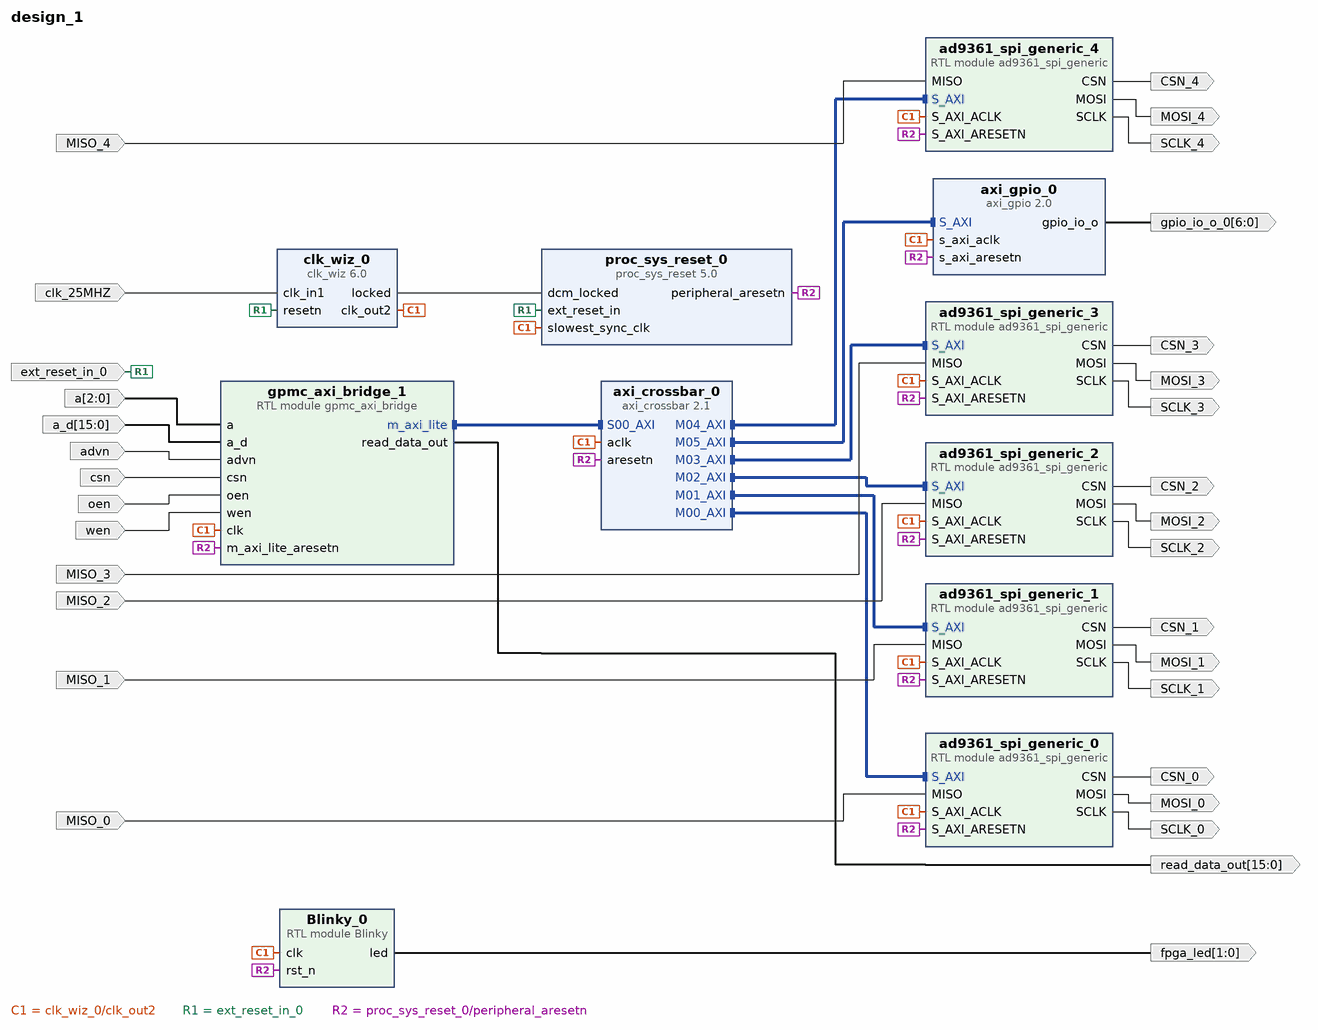
[diagram p0: block diagram of the top level]
# Vivado block design design_1, xc7a200tffg1156-1, Vivado 2025.2
create_bd_design design_1

create_bd_port -dir I advn
create_bd_port -dir I wen
create_bd_port -dir I oen
create_bd_port -dir I -from 15 -to 0 a_d
create_bd_port -dir I csn
create_bd_port -dir I -from 2 -to 0 a
create_bd_port -dir O CSN_0
create_bd_port -dir I MISO_0
create_bd_port -dir O MOSI_0
create_bd_port -dir O SCLK_0
create_bd_port -dir I MISO_1
create_bd_port -dir O MOSI_1
create_bd_port -dir O SCLK_1
create_bd_port -dir O CSN_1
create_bd_port -dir I MISO_2
create_bd_port -dir O SCLK_2
create_bd_port -dir O MOSI_2
create_bd_port -dir O CSN_2
create_bd_port -dir O SCLK_3
create_bd_port -dir O MOSI_3
create_bd_port -dir I MISO_3
create_bd_port -dir O CSN_3
create_bd_port -dir O SCLK_4
create_bd_port -dir O MOSI_4
create_bd_port -dir I MISO_4
create_bd_port -dir O CSN_4
create_bd_port -dir I -type clk clk_25MHZ
set_property -dict {CONFIG.FREQ_HZ 25000000} [get_bd_ports clk_25MHZ]
create_bd_port -dir I -type rst ext_reset_in_0
create_bd_port -dir O -from 15 -to 0 read_data_out
create_bd_port -dir O -from 1 -to 0 fpga_led
create_bd_port -dir O -from 6 -to 0 gpio_io_o_0

create_bd_cell -type module -reference gpmc_axi_bridge gpmc_axi_bridge_1
create_bd_cell -type module -reference ad9361_spi_generic ad9361_spi_generic_0
create_bd_cell -type module -reference ad9361_spi_generic ad9361_spi_generic_1
create_bd_cell -type module -reference ad9361_spi_generic ad9361_spi_generic_2
create_bd_cell -type module -reference ad9361_spi_generic ad9361_spi_generic_3
create_bd_cell -type module -reference ad9361_spi_generic ad9361_spi_generic_4
create_bd_cell -type ip -vlnv xilinx.com:ip:clk_wiz:6.0 clk_wiz_0
set_property -dict [list \
  CONFIG.CLKIN1_JITTER_PS 400.0 \
  CONFIG.CLKOUT1_JITTER 356.129 \
  CONFIG.CLKOUT1_PHASE_ERROR 237.727 \
  CONFIG.CLKOUT1_REQUESTED_OUT_FREQ 25 \
  CONFIG.CLKOUT2_JITTER 226.965 \
  CONFIG.CLKOUT2_PHASE_ERROR 237.727 \
  CONFIG.CLKOUT2_USED true \
  CONFIG.CLKOUT3_JITTER 206.578 \
  CONFIG.CLKOUT3_PHASE_ERROR 237.727 \
  CONFIG.CLKOUT3_REQUESTED_OUT_FREQ 200 \
  CONFIG.CLKOUT3_USED true \
  CONFIG.CLKOUT4_JITTER 220.126 \
  CONFIG.CLKOUT4_PHASE_ERROR 237.727 \
  CONFIG.CLKOUT4_REQUESTED_OUT_FREQ 125 \
  CONFIG.CLKOUT4_USED true \
  CONFIG.MMCM_CLKFBOUT_MULT_F 40.000 \
  CONFIG.MMCM_CLKIN1_PERIOD 40.000 \
  CONFIG.MMCM_CLKIN2_PERIOD 10.0 \
  CONFIG.MMCM_CLKOUT0_DIVIDE_F 40.000 \
  CONFIG.MMCM_CLKOUT1_DIVIDE 10 \
  CONFIG.MMCM_CLKOUT2_DIVIDE 5 \
  CONFIG.MMCM_CLKOUT3_DIVIDE 8 \
  CONFIG.NUM_OUT_CLKS 4 \
  CONFIG.PRIM_IN_FREQ 25 \
  CONFIG.RESET_PORT resetn \
  CONFIG.RESET_TYPE ACTIVE_LOW \
] [get_bd_cells clk_wiz_0]
create_bd_cell -type ip -vlnv xilinx.com:ip:proc_sys_reset:5.0 proc_sys_reset_0
create_bd_cell -type ip -vlnv xilinx.com:ip:axi_crossbar:2.1 axi_crossbar_0
set_property -dict {CONFIG.ADDR_WIDTH 19 CONFIG.NUM_MI 6 CONFIG.PROTOCOL AXI4LITE} [get_bd_cells axi_crossbar_0]
create_bd_cell -type module -reference Blinky Blinky_0
set_property -dict {CONFIG.BUS_WIDTH 2} [get_bd_cells Blinky_0]
create_bd_cell -type ip -vlnv xilinx.com:ip:axi_gpio:2.0 axi_gpio_0
set_property -dict {CONFIG.C_ALL_OUTPUTS 1 CONFIG.C_GPIO_WIDTH 7} [get_bd_cells axi_gpio_0]

# ---- connections ----

connect_bd_intf_net [get_bd_intf_pins axi_crossbar_0/M00_AXI] [get_bd_intf_pins ad9361_spi_generic_0/S_AXI]
connect_bd_intf_net [get_bd_intf_pins axi_crossbar_0/M01_AXI] [get_bd_intf_pins ad9361_spi_generic_1/S_AXI]
connect_bd_intf_net [get_bd_intf_pins axi_crossbar_0/M02_AXI] [get_bd_intf_pins ad9361_spi_generic_2/S_AXI]
connect_bd_intf_net [get_bd_intf_pins axi_crossbar_0/M03_AXI] [get_bd_intf_pins ad9361_spi_generic_3/S_AXI]
connect_bd_intf_net [get_bd_intf_pins axi_crossbar_0/M04_AXI] [get_bd_intf_pins ad9361_spi_generic_4/S_AXI]
connect_bd_intf_net [get_bd_intf_pins axi_crossbar_0/M05_AXI] [get_bd_intf_pins axi_gpio_0/S_AXI]
connect_bd_intf_net [get_bd_intf_pins gpmc_axi_bridge_1/m_axi_lite] [get_bd_intf_pins axi_crossbar_0/S00_AXI]
connect_bd_net [get_bd_pins Blinky_0/led] [get_bd_ports fpga_led]
connect_bd_net -net CLK_25MHZ_FPGA_1 [get_bd_ports clk_25MHZ] [get_bd_pins clk_wiz_0/clk_in1]
connect_bd_net -net MISO_0_1 [get_bd_ports MISO_0] [get_bd_pins ad9361_spi_generic_0/MISO]
connect_bd_net -net MISO_1_1 [get_bd_ports MISO_1] [get_bd_pins ad9361_spi_generic_1/MISO]
connect_bd_net -net MISO_2_1 [get_bd_ports MISO_2] [get_bd_pins ad9361_spi_generic_2/MISO]
connect_bd_net -net MISO_3_1 [get_bd_ports MISO_3] [get_bd_pins ad9361_spi_generic_3/MISO]
connect_bd_net -net MISO_4_1 [get_bd_ports MISO_4] [get_bd_pins ad9361_spi_generic_4/MISO]
connect_bd_net -net a_0_1 [get_bd_ports a] [get_bd_pins gpmc_axi_bridge_1/a]
connect_bd_net -net a_d_0_1 [get_bd_ports a_d] [get_bd_pins gpmc_axi_bridge_1/a_d]
connect_bd_net [get_bd_pins ad9361_spi_generic_0/CSN] [get_bd_ports CSN_0]
connect_bd_net [get_bd_pins ad9361_spi_generic_0/MOSI] [get_bd_ports MOSI_0]
connect_bd_net [get_bd_pins ad9361_spi_generic_0/SCLK] [get_bd_ports SCLK_0]
connect_bd_net [get_bd_pins ad9361_spi_generic_1/CSN] [get_bd_ports CSN_1]
connect_bd_net [get_bd_pins ad9361_spi_generic_1/MOSI] [get_bd_ports MOSI_1]
connect_bd_net [get_bd_pins ad9361_spi_generic_1/SCLK] [get_bd_ports SCLK_1]
connect_bd_net [get_bd_pins ad9361_spi_generic_2/CSN] [get_bd_ports CSN_2]
connect_bd_net [get_bd_pins ad9361_spi_generic_2/MOSI] [get_bd_ports MOSI_2]
connect_bd_net [get_bd_pins ad9361_spi_generic_2/SCLK] [get_bd_ports SCLK_2]
connect_bd_net [get_bd_pins ad9361_spi_generic_3/CSN] [get_bd_ports CSN_3]
connect_bd_net [get_bd_pins ad9361_spi_generic_3/MOSI] [get_bd_ports MOSI_3]
connect_bd_net [get_bd_pins ad9361_spi_generic_3/SCLK] [get_bd_ports SCLK_3]
connect_bd_net [get_bd_pins ad9361_spi_generic_4/CSN] [get_bd_ports CSN_4]
connect_bd_net [get_bd_pins ad9361_spi_generic_4/MOSI] [get_bd_ports MOSI_4]
connect_bd_net [get_bd_pins ad9361_spi_generic_4/SCLK] [get_bd_ports SCLK_4]
connect_bd_net -net advn_0_1 [get_bd_ports advn] [get_bd_pins gpmc_axi_bridge_1/advn]
connect_bd_net [get_bd_pins axi_gpio_0/gpio_io_o] [get_bd_ports gpio_io_o_0]
connect_bd_net [get_bd_pins clk_wiz_0/clk_out2] \
  [get_bd_pins ad9361_spi_generic_0/S_AXI_ACLK] [get_bd_pins ad9361_spi_generic_1/S_AXI_ACLK] \
  [get_bd_pins ad9361_spi_generic_3/S_AXI_ACLK] [get_bd_pins ad9361_spi_generic_4/S_AXI_ACLK] \
  [get_bd_pins axi_crossbar_0/aclk] [get_bd_pins ad9361_spi_generic_2/S_AXI_ACLK] \
  [get_bd_pins proc_sys_reset_0/slowest_sync_clk] [get_bd_pins gpmc_axi_bridge_1/clk] [get_bd_pins Blinky_0/clk] \
  [get_bd_pins axi_gpio_0/s_axi_aclk]
connect_bd_net [get_bd_pins clk_wiz_0/locked] [get_bd_pins proc_sys_reset_0/dcm_locked]
connect_bd_net -net csn_0_1 [get_bd_ports csn] [get_bd_pins gpmc_axi_bridge_1/csn]
connect_bd_net -net ext_reset_in_0_1 [get_bd_ports ext_reset_in_0] [get_bd_pins clk_wiz_0/resetn] [get_bd_pins proc_sys_reset_0/ext_reset_in]
connect_bd_net [get_bd_pins gpmc_axi_bridge_1/read_data_out] [get_bd_ports read_data_out]
connect_bd_net -net oen_0_1 [get_bd_ports oen] [get_bd_pins gpmc_axi_bridge_1/oen]
connect_bd_net [get_bd_pins proc_sys_reset_0/peripheral_aresetn] \
  [get_bd_pins ad9361_spi_generic_0/S_AXI_ARESETN] [get_bd_pins ad9361_spi_generic_1/S_AXI_ARESETN] \
  [get_bd_pins ad9361_spi_generic_2/S_AXI_ARESETN] [get_bd_pins ad9361_spi_generic_3/S_AXI_ARESETN] \
  [get_bd_pins ad9361_spi_generic_4/S_AXI_ARESETN] [get_bd_pins gpmc_axi_bridge_1/m_axi_lite_aresetn] \
  [get_bd_pins axi_crossbar_0/aresetn] [get_bd_pins Blinky_0/rst_n] [get_bd_pins axi_gpio_0/s_axi_aresetn]
connect_bd_net -net wen_0_1 [get_bd_ports wen] [get_bd_pins gpmc_axi_bridge_1/wen]

# ---- address map ----
assign_bd_address -offset 0x01000 -range 4K -target_address_space [get_bd_addr_spaces gpmc_axi_bridge_1/m_axi_lite] [get_bd_addr_segs ad9361_spi_generic_0/S_AXI/reg0]
assign_bd_address -offset 0x02000 -range 4K -target_address_space [get_bd_addr_spaces gpmc_axi_bridge_1/m_axi_lite] [get_bd_addr_segs ad9361_spi_generic_1/S_AXI/reg0]
assign_bd_address -offset 0x03000 -range 4K -target_address_space [get_bd_addr_spaces gpmc_axi_bridge_1/m_axi_lite] [get_bd_addr_segs ad9361_spi_generic_2/S_AXI/reg0]
assign_bd_address -offset 0x04000 -range 4K -target_address_space [get_bd_addr_spaces gpmc_axi_bridge_1/m_axi_lite] [get_bd_addr_segs ad9361_spi_generic_3/S_AXI/reg0]
assign_bd_address -offset 0x05000 -range 4K -target_address_space [get_bd_addr_spaces gpmc_axi_bridge_1/m_axi_lite] [get_bd_addr_segs ad9361_spi_generic_4/S_AXI/reg0]
assign_bd_address -offset 0x07000 -range 4K -target_address_space [get_bd_addr_spaces gpmc_axi_bridge_1/m_axi_lite] [get_bd_addr_segs axi_gpio_0/S_AXI/Reg]

validate_bd_design
save_bd_design
